# Altium schematic sheet Sheet1.SchDoc
size A2
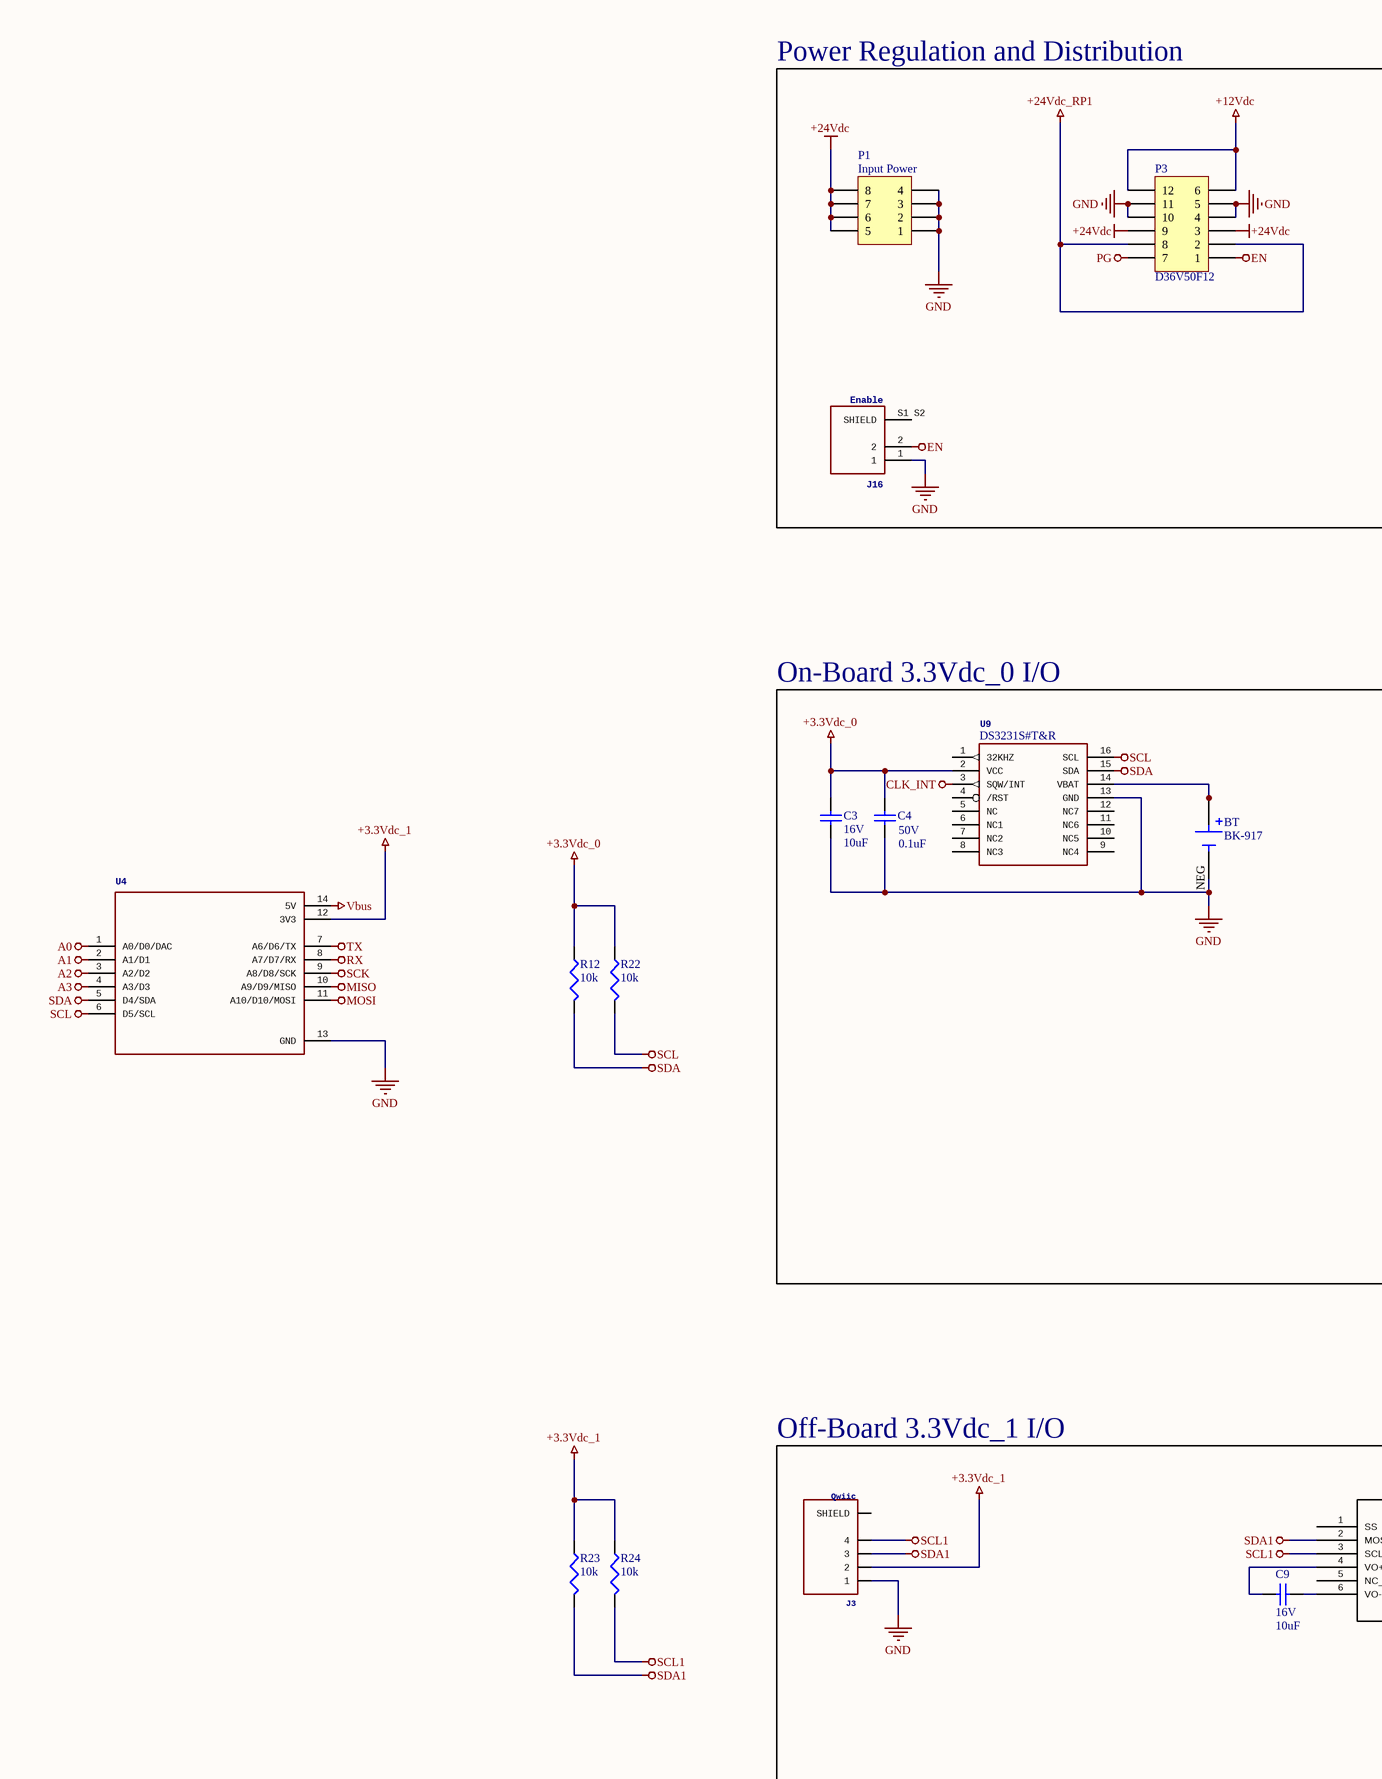
[diagram p0: Sheet1.SchDoc, left]
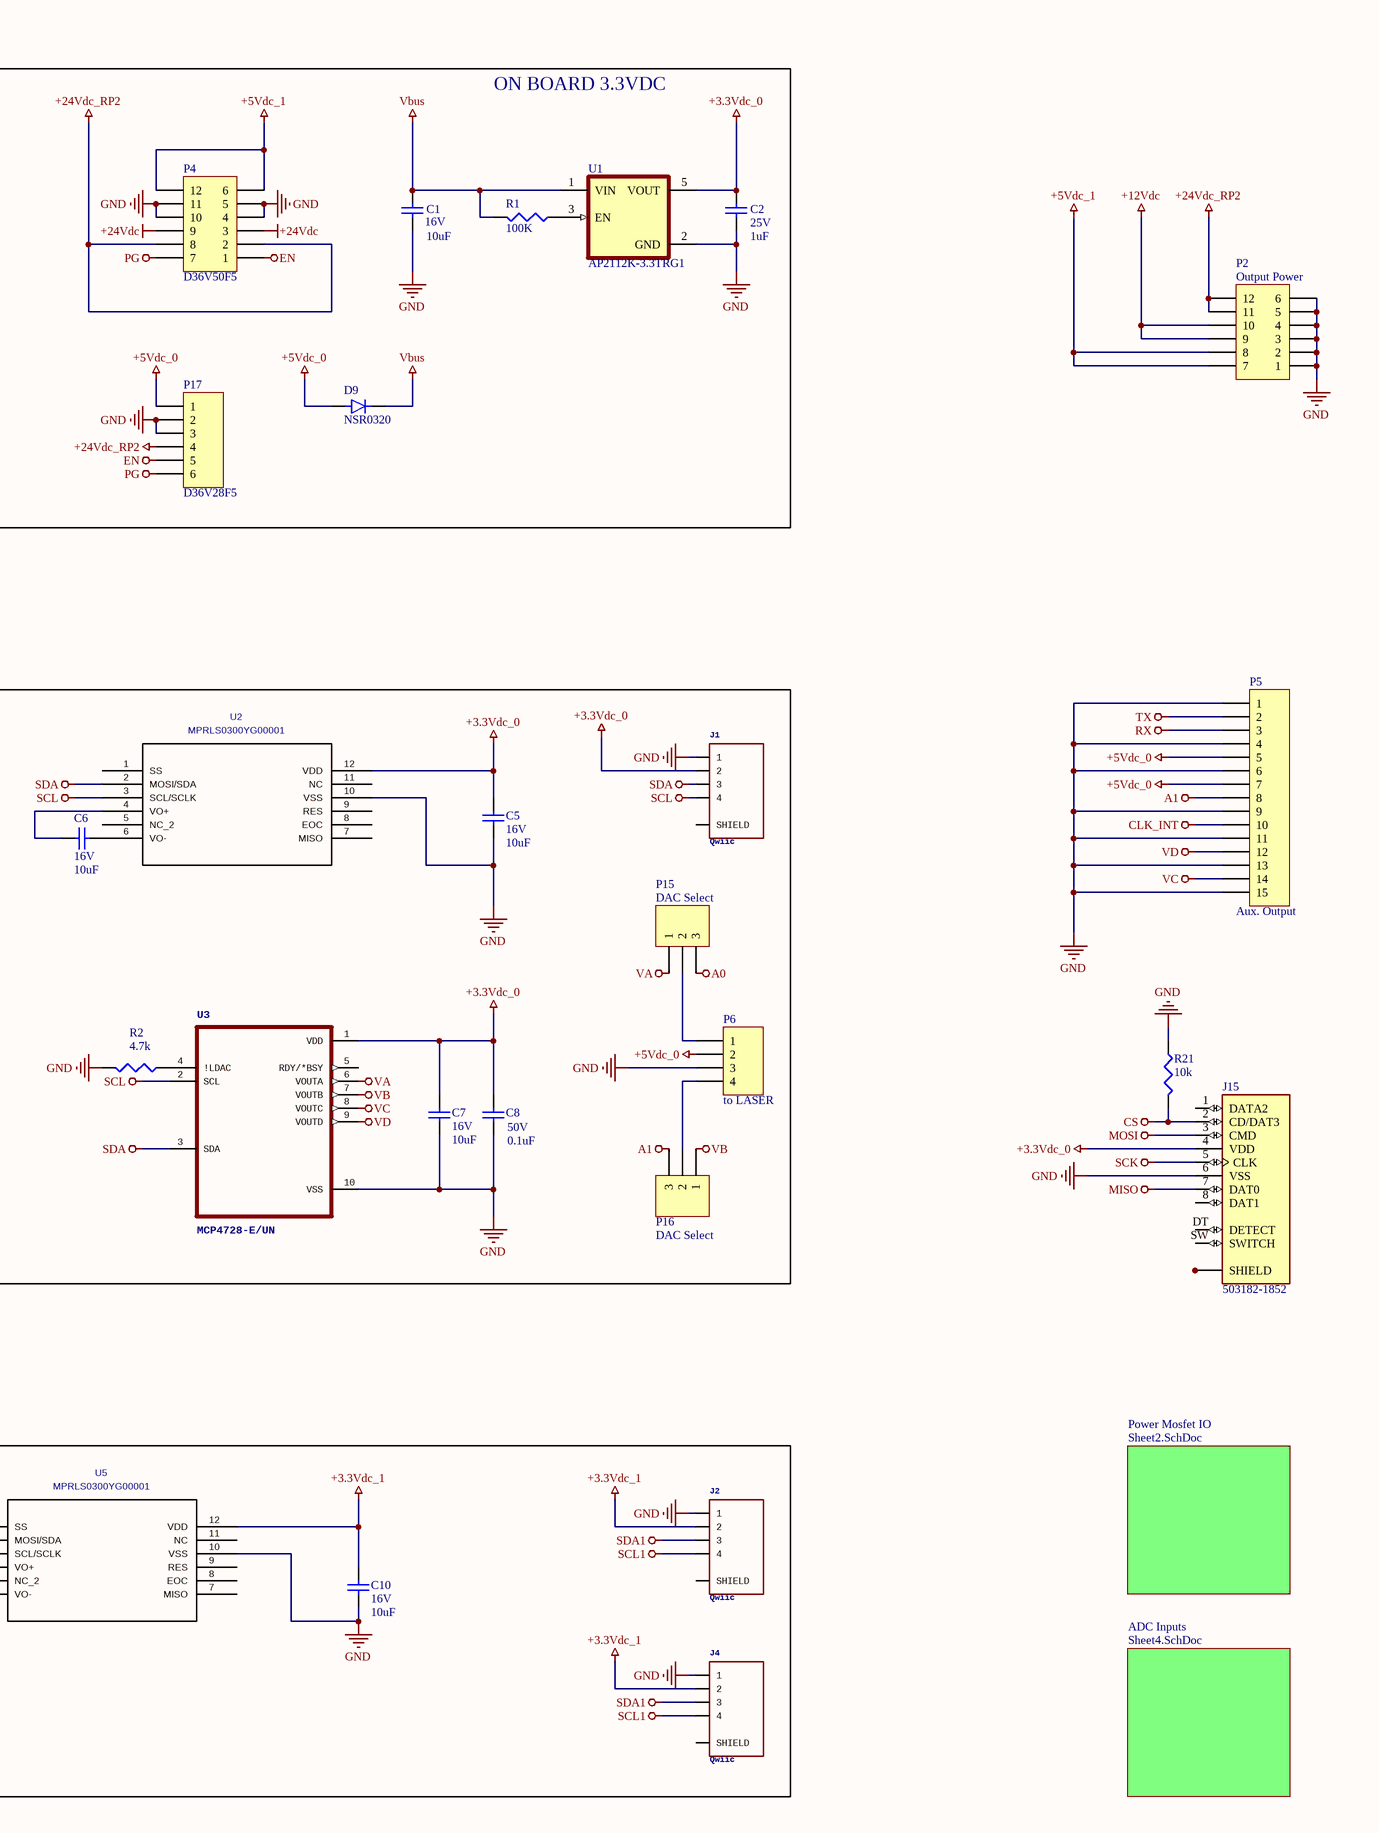
[diagram p1: Sheet1.SchDoc, right]

## Parts
BT  BK-917  [BAT_BK-917]
C1  16V  value 10uF  [1608[0603]]
C2  25V  value 1uF  [1608[0603]]
C3  16V  value 10uF  [1608[0603]]
C4  50V  value 0.1uF  [1608[0603]]
C5  16V  value 10uF  [1608[0603]]
C6  16V  value 10uF  [1608[0603]]
C7  16V  value 10uF  [1608[0603]]
C8  50V  value 0.1uF  [1608[0603]]
C9  16V  value 10uF  [1608[0603]]
C10  16V  value 10uF  [1608[0603]]
D9  NSR0320  [DIO_MM3Z3V0T1G]
J1  Qwiic  [4P vert]
J2  Qwiic  [4P vert]
J3  Qwiic  [JST_SM04B-SRSS-TB(LF)(SN)]
J4  Qwiic  [JST_SM04B-SRSS-TB(LF)(SN)]
J15  503182-1852  [MOLEX_503182-1852]
J16  Enable  [CONN_BM04B-SRSS-TB(LF)(SN)]
P1  Input Power  [2X4 VERTICAL]
P2  Output Power  [MOLEX_430451214]
P3  D36V50F12  [D36V50FXX, 4.5A]
P4  D36V50F5  [D36V50FXX, 4.5A]
P5  Aux. Output  [15P VERT]
P6  to LASER  [4P Mini-SPOX]
P15  DAC Select  [HDR1X3]
P16  DAC Select  [HDR1X3]
P17  D36V28F5  [D36V28Fx, 3A]
R1  value 100K  [J1-0603]  (hidden comment: Res3)
R2  value 4.7k  [0402]  (hidden comment: Res3)
R12  value 10k  [0402]  (hidden comment: Res3)
R21  value 10k  [0402]  (hidden comment: Res3)
R22  value 10k  [0402]  (hidden comment: Res3)
R23  value 10k  [0402]  (hidden comment: Res3)
R24  value 10k  [0402]  (hidden comment: Res3)
U1  AP2112K-3.3TRG1  [SOT95P285X140-5N]
U2  MPRLS0300YG00001  [MPRLS0300YG00000]
U3  MCP4728-E/UN  [SOP50P490X110-10N]
U4  Check availability  [MODULE_ADAFRUIT_QT_PY]  (value not drawn)
U5  MPRLS0300YG00001  [MPRLS0300YG00000]
U9  DS3231S#T&R  [SO16W]

## Blocks framed on the sheet
Power Regulation and Distribution: C1 C2 D9 J16 P1 P3 P4 P17 R1 U1
On-Board 3.3Vdc_0 I/O: BT C3-C8 J1 P6 P15 P16 R2 U2 U3 U9
Off-Board 3.3Vdc_1 I/O: C9 C10 J2-J4 U5

## Sub-sheets
ADC Inputs = Sheet4.SchDoc: no entries
Power Mosfet IO = Sheet2.SchDoc: no entries

## Nets
+3.3Vdc_0: C2.2 C3.1 C4.1 C5.1 C7.1 C8.1 J1.2 J15.4(VDD) R12.1 R22.1 U1.5(VOUT) U2.12(VDD) U3.1(VDD) U9.2(VCC)
+3.3Vdc_1: C10.1 J2.2 J3.2 J4.2 R23.1 R24.1 U4.12(3V3) U5.12(VDD)
+5Vdc_0: D9.A P5.5 P5.7 P6.2 P17.1
+5Vdc_1: P2.7 P2.8 P4.6 P4.12
+12Vdc: P2.9 P2.10 P3.6 P3.12
+24Vdc: P1.5 P1.6 P1.7 P1.8 P3.3 P3.9 P4.3 P4.9
+24Vdc_RP1: P3.2 P3.8
+24Vdc_RP2: P2.11 P2.12 P4.2 P4.8 P17.4
A0: P15.3 U4.1(A0/D0/DAC)
A1: P5.8 P16.3 U4.2(A1/D1)
A2: U4.3(A2/D2)
A3: U4.4(A3/D3)
CLK_INT: P5.10 U9.3(SQW/INT)
CS: J15.2(CD/DAT3) R21.2
EN: J16.2 P3.1 P4.1 P17.5
GND: BT.NEG C1.1 C2.1 C3.2 C4.2 C5.2 C7.2 C8.2 C10.2 J1.1 J2.1 J3.1 J4.1 J15.6(VSS) J16.1 P1.1 P1.2 P1.3 P1.4 P2.1 P2.2 P2.3 P2.4 P2.5 P2.6 P3.4 P3.5 P3.10 P3.11 P4.4 P4.5 P4.10 P4.11 P5.1 P5.4 P5.6 P5.9 P5.11 P5.13 P5.15 P6.3 P17.2 P17.3 R2.2 R21.1 U1.2(GND) U2.10(VSS) U3.10(VSS) U4.13(GND) U5.10(VSS) U9.13(GND)
MISO: J15.7(DAT0) U4.10(A9/D9/MISO)
MOSI: J15.3(CMD) U4.11(A10/D10/MOSI)
PG: P3.7 P4.7 P17.6
RX: P5.3 U4.8(A7/D7/RX)
SCK: J15.5(CLK) U4.9(A8/D8/SCK)
SCL: J1.4 R22.2 U2.3(SCL/SCLK) U3.2(SCL) U4.6(D5/SCL) U9.16(SCL)
SCL1: J2.4 J3.4 J4.4 R24.2 U5.3(SCL/SCLK)
SDA: J1.3 R12.2 U2.2(MOSI/SDA) U3.3(SDA) U4.5(D4/SDA) U9.15(SDA)
SDA1: J2.3 J3.3 J4.3 R23.2 U5.2(MOSI/SDA)
TX: P5.2 U4.7(A6/D6/TX)
VA: P15.1 U3.6(VOUTA)
VB: P16.1 U3.7(VOUTB)
Vbus: C1.2 D9.C(K) R1.2 U1.1(VIN) U4.14(5V)
VC: P5.14 U3.8(VOUTC)
VD: P5.12 U3.9(VOUTD)
NetBT_1+: BT.1+(POS) BT.2+(POS) BT.3+(POS) BT.4+(POS) U9.14(VBAT)
NetC6_1: C6.1 U2.6(VO-)
NetC6_2: C6.2 U2.4(VO+)
NetC9_1: C9.1 U5.4(VO+)
NetC9_2: C9.2 U5.6(VO-)
NetJ15_P1: J15.P1(SHIELD) J15.P2(SHIELD) J15.P3(SHIELD) J15.P4(SHIELD) J15.P5(SHIELD)
NetP6_1: P6.1 P15.2
NetP6_4: P6.4 P16.2
NetR1_1: R1.1 U1.3(EN)
NetR2_1: R2.1 U3.4(!LDAC)

Not connected (* = marked no-connect by the designer): J1 S1 S2(SHIELD); J2 S1 S2(SHIELD); J3 S1 S2(SHIELD); J4 S1 S2(SHIELD); J15 1(DATA2) 8(DAT1) DT(DETECT) SW(SWITCH); J16 S1 S2(SHIELD); U2 1(SS) 5(NC_2) 7(MISO) 8(EOC) 9(RES) 11(NC); U3 5(RDY/*BSY); U5 1(SS) 5(NC_2) 7(MISO) 8(EOC) 9(RES) 11(NC); U9 1(32KHZ) 4(/RST) 5(NC) 6(NC1) 7(NC2) 8(NC3) 9(NC4) 10(NC5) 11(NC6) 12(NC7)

## Notes on the sheet
- ON BOARD 3.3VDC
- Title
- Size:
- Date:
- File:
- A2
- Number:
- Time:
- Revision:
- Sheet
- of

## Library data of the parts
BT = BK-917: BATTERY RETAINER COIN PC PIN; Manufacturer: MPD; Manufacturer Part #: BK-917
C1 C3 C5-C7 C9 C10 = Cap Semi: CAP CER 10UF 16V X5R 0603; Manufacturer Part #: CC0603KRX5R7BB106; Manufacturer: YAGEO; Footprints: 0603
C2 = Cap Semi: CAP CER 1UF 25V X7R 0603; Manufacturer Part #: AC0603KRX7R8BB105; Manufacturer: YAGEO; Footprints: 0603
C4 C8 = Cap Semi: CAP CER 0.1UF 50V X7R 0603; Manufacturer Part #: CC0603KPX7R9BB104; Manufacturer: YAGEO; Footprints: 0603
D9 = S1M: DIODE SCHOTTKY 20V 1A SOD323; Manufacturer Part #: NSR0320MW2T1G; Manufacturer: onsemi; Footprint: SOD-323
J1 J2 = SM04B-SRSS-TB(LF)(SN): Manufacturer Part #: BM04B-SRSS-TB(LF)(SN); Manufacturer: JST Sales
J3 J4 = SM04B-SRSS-TB(LF)(SN): Manufacturer: JST Sales; Manufacturer Part #: SM04B-SRSS-TB(LF)(SN)
J15 = 503182-1852: 10 (8 + 2) Position Card Connector Secure Digital - microSDâ„¢ Surface Mount, Right Angle Gold; Manufacturer: Molex; Manufacturer Part #: 5031821852
J16 = BM04B-SRSS-TB(LF)(SN): Manufacturer: JST Sales; Manufacturer Part #: BM04B-SRSS-TB(LF)(SN)
P1 = Header 4X2A: CONN HEADER VERT 8POS 3MM; Manufacturer Part #: 0430450827; Manufacturer: Molex; Do Not Install: *; Vendor: *; Vendor Part Number: *
P2 = Header 6X2A: CONN HEADER VERT 12POS 3MM; Manufacturer Part #: 0430451227; Manufacturer: Molex
P3 = Header 6X2A: DC DC CONVERTER 12V 54W; Vendor Part Number: 2183-4095-ND; Manufacturer: Pololu; Vendor: digikey; Manufacturer Part #: D36V50F12; Do Not Install: *
P4 = Header 6X2A: 12V, 4.5A Step-Down Voltage Regulator5V, 5.5A Step-Down Voltage Regulator; Vendor: Pololu; Manufacturer Part #: D36V50F5; Do Not Install: *; Vendor Part Number: D36V50F5; Manufacturer: Pololu
P5 = Header 15: Header, 15-Pin; Manufacturer Part #: BM15B-SRSS-TB(LF)(SN); Manufacturer: JST Sales America Inc.
P6 = Header 4: Connector Header Through Hole, Right Angle 4 position 0.098" (2.50mm); Manufacturer Part #: 0022057045; Manufacturer: Molex
P15 P16 = Header 3: Header, 3-Pin; Manufacturer Part #: 68000-103HLF; Manufacturer: Amphenol ICC (FCI)
P17 = Header 6: 5V, 3.2A Step-Down Voltage Regulator; Vendor: Pololu; Manufacturer Part #: D36V28F5; Vendor Part Number: D36V28F5; Manufacturer: Pololu
R1 = Res3: RES 100K OHM 1% 1/4W 0603; Manufacturer Part #: SR0603FR-7T100KL; Manufacturer: YAGEO; Footprints: 0603
R2 = Res3: RES 4.7K OHM 1% 1/5W 0402; Manufacturer Part #: SR0402FR-7T4K7L; Manufacturer: YAGEO; Footprints: 0402
R12 R21-R24 = Res3: RES 10 KOHM 1% 1/8W 0402; Manufacturer Part #: AC0402FR-7W10KL; Manufacturer: YAGEO; Footprints: 0402
U1 = AP2112K-3.3TRG1: IC REG LINEAR 3.3V 600MA SOT25; Manufacturer: Diodes Incorporated; Manufacturer Part #: AP2112K-3.3TRG1; Footprint: SOT-25
U2 U5 = MPRLS0300YG00001: Manufacturer: Honeywell; Manufacturer Part #: MPRLS0300YG00001B
U3 = MCP4728-E/UN: Manufacturer: Microchip; Manufacturer Part #: MCP4728-E/UN
U4 = ADAFRUIT_QT_PY: WiFi Dev Board with STEMMA QT - 8 MB Flash / No PSRAM; Manufacturer Part #: QT PY ESP32-S3; Vendor Part Number: 5426; Do Not Install: DNI; Vendor: Adafruit
U9 = DS3231/SO: Real-Time Clock; Manufacturer: Maxim; Manufacturer Part #: DS3231S#T&R